# Altium schematic sheet PIBSchematic.SchDoc
size A4; SheetNumber: 1; SheetTotal: 1
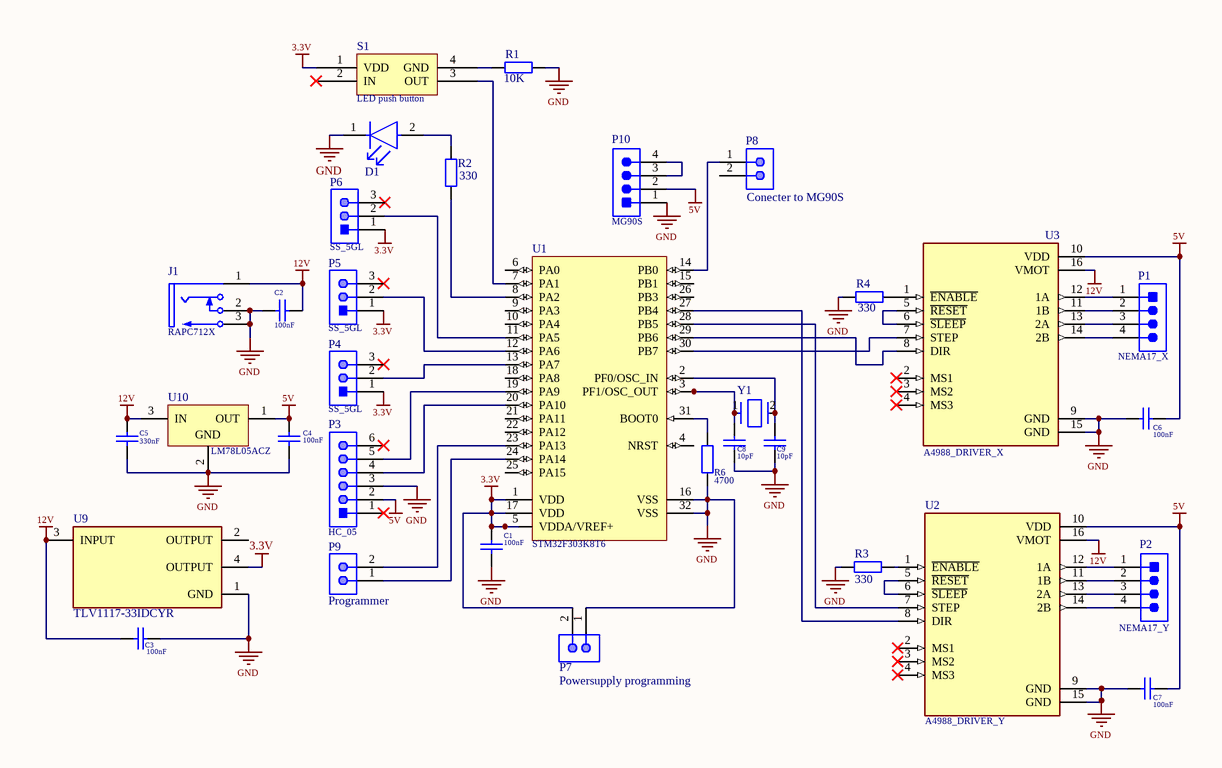
[diagram p0: PIBSchematic.SchDoc]

## Parts
C1  100nF  [KEMT-1206-2_M]
C2  100nF  [KEMT-1206-2_M]
C3  100nF  [KEMT-1206-2_M]
C4  100nF  [KEMT-1206-2_M]
C5  330nF  [KEMT-1206-2_M]
C6  100nF  [KEMT-1206-2_M]
C7  100nF  [KEMT-1206-2_M]
C8  10pF  [KEMT-1206-2_M]
C9  10pF  [KEMT-1206-2_M]
D1  HLMP-1719  [FP-HLMP-1719-MFG]  (value not drawn)
J1  RAPC712X  [SWITCH-RAPC712X-3_V]
P1  NEMA17_X  [TECO-640456-4]
P2  NEMA17_Y  [TECO-640456-4]
P3  HC_05  [66200611122]
P4  SS_5GL  [66200311122]
P5  SS_5GL  [66200311122]
P6  SS_5GL  [66200311122]
P7  Powersupply programming  [TECO-5-146280-2_V]
P8  Conecter to MG90S  [TECO-5-146280-2_V]
P9  Programmer  [TECO-5-146280-2_V]
P10  MG90S  [TECO-640456-4]
R1  value 10K  [AXIAL-0.4]  (hidden comment: Res2)
R2  value 330  [AXIAL-0.4]  (hidden comment: Res2)
R3  value 330  [AXIAL-0.4]  (hidden comment: Res2)
R4  value 330  [AXIAL-0.4]  (hidden comment: Res2)
R6  value 4700  [AXIAL-0.4]  (hidden comment: Res2)
S1  LED push button  [PCBComponent_1]
U1  STM32F303K8T6  [STM-LQFP32_M]
U2  A4988_DRIVER_Y  [MODULE_A4988_STEPPER_MOTOR_DRIVER_CARRIER]
U3  A4988_DRIVER_X  [MODULE_A4988_STEPPER_MOTOR_DRIVER_CARRIER]
U9  TLV1117-33IDCYR  [FP-DCY0004A-MFG]
U10  LM78L05ACZ  [LP0003A]
Y1  ABLS2-8.000MHZ-D4Y-T  [FP-ABLS2-MFG]  (value not drawn)

## Nets
3.3V: C1.2 P4.1 P5.1 P6.1 P7.2 S1.1(VDD) U1.1(VDD) U1.5(VDDA/VREF+) U1.17(VDD) U9.4(OUTPUT)
5V: C4.1 C6.1 C7.1 P3.2 P10.2 U2.10(VDD) U3.10(VDD) U10.1(OUT)
12V: C2.2 C3.2 C5.2 J1.1 U2.16(VMOT) U3.16(VMOT) U9.3(INPUT) U10.3(IN)
GND: C1.1 C2.1 C3.1 C4.2 C5.1 C6.2 C7.2 C8.2 C9.2 D1.1(C) J1.2 J1.3 P3.3 P7.1 P10.1 R1.2 R3.1 R4.1 R6.1 U1.16(VSS) U1.32(VSS) U2.9(GND) U2.15(GND) U3.9(GND) U3.15(GND) U9.1(GND) U10.2(GND)
NetC8_1: C8.1 U1.3(PF1/OSC_OUT) Y1.1
NetC9_1: C9.1 U1.2(PF0/OSC_IN) Y1.2
NetD1_2: D1.2(A) R2.2
NetP1_1: P1.1 U3.12(1A)
NetP1_2: P1.2 U3.11(1B)
NetP1_3: P1.3 U3.13(2A)
NetP1_4: P1.4 U3.14(2B)
NetP2_1: P2.1 U2.12(1A)
NetP2_2: P2.2 U2.11(1B)
NetP2_3: P2.3 U2.13(2A)
NetP2_4: P2.4 U2.14(2B)
NetP3_4: P3.4 U1.20(PA10)
NetP3_5: P3.5 U1.19(PA9)
NetP4_2: P4.2 U1.13(PA7)
NetP5_2: P5.2 U1.12(PA6)
NetP6_2: P6.2 U1.11(PA5)
NetP8_1: P8.1 U1.14(PB0)
NetP9_1: P9.1 U1.24(PA14)
NetP9_2: P9.2 U1.23(PA13)
NetP10_3: P10.3 P10.4
NetR1_1: R1.1 S1.4(GND)
NetR2_1: R2.1 U1.8(PA2)
NetR3_2: R3.2 U2.1(~{ENABLE})
NetR4_2: R4.2 U3.1(~{ENABLE})
NetR6_2: R6.2 U1.31(BOOT0)
NetS1_3: S1.3(OUT) U1.7(PA1)
NetU1_27: U1.27(PB4) U2.8(DIR)
NetU1_28: U1.28(PB5) U2.7(STEP)
NetU1_29: U1.29(PB6) U3.8(DIR)
NetU1_30: U1.30(PB7) U3.7(STEP)
NetU2_5: U2.5(~{RESET}) U2.6(~{SLEEP})
NetU3_5: U3.5(~{RESET}) U3.6(~{SLEEP})

Not connected (* = marked no-connect by the designer): P3 1* 6*; P4 3*; P5 3*; P6 3*; P8 2; S1 2(IN)*; U1 4(NRST) 6(PA0) 9(PA3) 10(PA4) 15(PB1) 18(PA8) 21(PA11) 22(PA12) 25(PA15) 26(PB3); U2 2(MS1)* 3(MS2)* 4(MS3)*; U3 2(MS1)* 3(MS2)* 4(MS3)*; U9 2(OUTPUT)

## Notes on the sheet
- Size:
- Date:
- Drawn by:
- Revision:
- Hogeschool Windesheim
- Campus 2-6
- Postbus 10090
- A4
- Sheet
- of
- 8000GB, Zwolle

## Library data of the parts
C1-C9 = CMP-1037-04202-2: CAP, Ceramic, 0.1 uF, +/- 10%, 50 V, -55 to 125 degC, 1206 (3216 Metric), RoHS, Tape and Reel; Manufacturer: Kemet; Voltage Rating: 50V; Capacitance: 0.1µF; Product Range: KEMET-CSeries; SVHC: ToBeAdvised; Dielectric Characteristic: X7R; Capacitor Case Style: 1206[3216Metric]; Package Reference: 1206-2; Package Description: 2-Leads SMD, Body 3.2 x 1.6 mm; Packaging: Tape&Reel; Operating Temperature Max: 125degC; Capacitance Tolerance: ±10%; Datasheet URL: https://datasheet.ciiva.com/6125/1725438-6125494.pdf; Manufacturer URL: http://www.kemet.com/; Operating Temperature Min: -55degC; Datasheet Version: Jul-13
D1 = CMP-2000-06410-2: LED YELLOW DIFFUSED T-1 T/H; Manufacturer: Broadcom; Wavelength: 585nm; Led Orientation: Straight; Luminous Intensity: 2.1mcd; Forward Voltage: 1.8V; Viewing Angle: 50°; Reverse Voltage: 5V; Power Dissipation: 17.5mW; Forward Current: 2mA; Lead Free: Yes; Automotive: No; Device Class L1: Optoelectronics; Mouser Description: Standard LEDs - Through Hole Yellow Diffused 585nm 2.1mcd; Digikey Description: LED YELLOW DIFFUSED T-1 T/H; Temperature: -40°C to +100°C; Temperature Range High: +100°C; Package: 0; Category: Diode; Colour: Yellow; Device Class L2: LEDs; ComponentLink2Description: Datasheet; ComponentLink2URL: https://docs.broadcom.com/docs/AV02-1557EN; Temperature Range Low: -40°C; Device Class L3: unset; Octopart: https://octopart.com/hlmp-1719-broadcom-71130405; RoHS: TRUE; Manufacturer Part Number: HLMP-1719
J1 = CMP-2000-05383-1: Conn Powerjack Mini R/A PCMT, 5 A, 3-Pin THD, RoHS; Manufacturer: Switchcraft; Gender: Male; Current Rating: 5A; Connector Type: Jack; Dynamic Catalog: SwitchcraftInc; Other Names: Q2387461 / Q2526383 / RAPC712X-ND / SC237; Internal Switch(s): SingleSwitch,NormallyClosed; Catalog Drawings: RAPC7(1,2)2XSide / RAPC7(1,2)2XTop; Plug/Mating Plug Diameter: 2.5mmID,5.5mmOD; Number of Positions/Contacts: 2Conductors,2Contacts; Shielding: Unshielded; Mating Products: SC1539-ND / -CONNPLUGMINIPWR2CONDBLK/RED / SC1051-ND / -CONNPLUGMINIPOWER2CONDBLACK; Mounting Type: ThroughHole,RightAngle; Manufacturer URL: http://www.switchcraft.com/; Contact Material: Brass; Standard Package: 2,500; RoHS Information: SwitchcraftRoHSInfo; Termination: SolderEyelet(s); Housing Color: Black; Datasheet Version: Rev. A, 08/2005; Family: Barrel-PowerConnectors; Housing Material: Thermoplastic; Color: Black; Datasheet URL: https://datasheet.ciiva.com/391/rapc712x-cd-391666.pdf; Category: Connectors,Interconnects; Contact Material - Plating: Nickel
P1 P2 P10 = CMP-2000-05419-1: Male Header, Pitch 2.54 mm, 1 x 4 Position, Height 10.03 mm, Tail Length 3.56 mm, RoHS, Bulk; Manufacturer: TE Connectivity; Material, Housing: Polyester; Primary Type: InterconnectSystem; Mount Angle: Vertical; Color, Housing: White; Current, Rating: 5 / A; Agency Approvals: CSA,UL; Contact Termination Area Plating: Tin; Temperature, Operating: -55to+105 / degC; Standards: RoHSCompliant,ELVCompliant,UL94V-0; Number of Positions: 4; Brand/Series: MTA-100Series; Angle: Straight; Pin Spacing: 0.1 / "; Material, Contact: CopperAlloy; Connector Type: MTA-100; Special Features: Pinstrip; Mounting Hole Size: 0.04 / "; Contact Centerline Spacing: 0.100 / in.; Voltage, Rating: 250 / V; Manufacturer URL: http://www.te.com/; Length, Pin: 0.14 / "; Length, Overall: 0.4 / "; Color: White; Flammability Rating: UL94V-0; Mounting Type: PCMount; Termination: Solder; Datasheet URL: https://datasheet.ciiva.com/16286/eng-ds-82056-mta-0608-16286228.pdf; Number of Contacts: 4; Contact Shape: Square; Contact Mating Area Plating: Tin; Length, Terminal Post: 0.14 / in.; Size, Post: 0.025 / in.; Contact Plating: Tin; Type: PCBPlug; Datasheet Version: Dec-14; Number of Rows: 1
P3 = CMP-1502-00444-1: THT Male Header WR-MPC3, Vertical, Single Row, pitch 3 mm, 6 pins; Manufacturer: Wurth Elektronik; Working Voltage: 250VAC; Contact Resistance: 10mOhm; Pin Number: 6; Pitch: 3mm; Package Reference: 66200611122; Manufacturer URL: http://www.we-online.de; Packaging: Tube; Operating Temperature: -40to105degC; Publisher: WurthElektronik; Datasheet URL: https://katalog.we-online.de/em/datasheet/6620xx11122.pdf; Mounting Technology: THT; Gender: Male; Part Number: 66200611122; Orientation: Vertical
P4-P6 = CMP-1502-00441-1: THT Male Header WR-MPC3, Vertical, Single Row, pitch 3 mm, 3 pins; Manufacturer: Wurth Elektronik; Pitch: 3mm; Contact Resistance: 10mOhm; Working Voltage: 250VAC; Pin Number: 3; Gender: Male; Operating Temperature: -40to105degC; Part Number: 66200311122; Publisher: WurthElektronik; Package Reference: 66200311122; Orientation: Vertical; Datasheet URL: https://katalog.we-online.de/em/datasheet/6620xx11122.pdf; Mounting Technology: THT; Manufacturer URL: http://www.we-online.de; Packaging: Tube
P7-P9 = CMP-2000-07492-1: Male Header, Pitch 2.54 mm, 1 x 2 Position, Height 8.21 mm, Tail Length 3.05 mm, -65 to 105 degC, RoHS, Bulk; Manufacturer: TE Connectivity; Mating Connector Lock: No(Without); Number of Positions: 2; Pitch: 2.54mm; PCB Mounting Orientation: Vertical; Keyed: No; Case\/Package: 100; Mating Post Length: 0.23inch; High Temperature Housing: Yes; Max Current Rating: 5A; PCB Thickness: 0.063inch; PCB Mount Retention: Without; Approvals: CSA; Current Rating: 3A; Radiation Hardening: No; Length: 4.67mm; Contact Mating Length: 0.23inch; Connector Type: Header; Number of Rows: 1; Termination Post Length: 0.12inch; Board Standoff: No(Without); Max Operating Temperature: 105degC; Contact Shape: Square; Selectively Loaded: No(Without); Gasket: No(Without); Number of Contacts: 2; Contact Gender: Male; Mating Alignment: No(Without); Manufacturer URL: http://www.te.com/; Datasheet URL: http://www.te.com/commerce/DocumentDelivery/DDEController?Action=showdoc&DocId=Customer+Drawing%7F146280%7FH1%7Fpdf%7FEnglish%7FENG_CD_146280_H1.pdf%7F5-146280-2; Mount: ThroughHole; Orientation: Straight; Packaging: Carton; Package Reference: 5-146280-2; Package Quantity: 500; Stabilizers: No(Without); Row Spacing: 2.54mm; Contact Material: CopperAlloy; Panel Mount Retention: No(Without); Datasheet Version: Rev. H1, 08/2016; Housing Colour: Black; Colour: Black; Package Description: Male Header, Pitch 2.54 mm, 1 x 2 Position, Height 8.21 mm, Tail Length 3.05 mm; Contact Plating: Matte; Housing Material: Polymer; Contact Protection: No(Without); Min Operating Temperature: -65degC; Mounting Technology: ThroughHole; Flammability Rating: UL94V-0; RoHSCompliant: true; Termination: ThroughHole; Depth: 2.34mm; High Speed Serial Data Connector: No
R1-R4 R6 = Res2: Resistor; Published: 8-Jun-2000; LatestRevisionDate: 17-Jul-2002; LatestRevisionNote: Re-released for DXP Platform.; PackageReference: AXIAL-0.4; Publisher: Altium Limited; PackageDescription: Axial Device, Thru-Hole; 2 Leads; 0.4 in Pin Spacing
U1 = CMP-0537-00040-1: ARM Cortex-M4 32-bit MCU, 64 KB Flash, 16 KB Internal RAM, 25 I/Os, 32-Pin LQFP, -40 to 85 degC, Tray; Supply Voltage(Vcc) min (V): 2; Internal RAM Size (kB): 16; D/A Converter: 3; FLASH Size (Prog) (kB): 64; I/Os (High Current): 25; Operating Frequency(F) (Processor speed) (MHz): 72; ComponentLink1URL: http://www.st.com/; Package Description: 32-Pin Low Profile Quad Flat Package, 7 x 7 mm Body, 0.8 mm Pitch; Mounting Technology: Surface Mount; ComponentLink2Description: Datasheet; ComponentLink2URL: http://www.st.com/st-web-ui/static/active/en/resource/technical/document/datasheet/DM00092070.pdf; Core: ARM Cortex-M4; ComponentLink1Description: Manufacturer URL; Package Reference: LQFP32; Packing: Tray; DatasheetVersion: Rev. 4
U2 U3 = A4988_STEPPER_MOTOR_DRIVER_CARRIER: Stepper Motor Driver; MP: A4988 STEPPER MOTOR DRIVER CARRIER; MF: Pololu; Availability: Unavailable; Price: None; Package: None; Value: *; SnapEDA_Link: https://www.snapeda.com/parts/A4988%20STEPPER%20MOTOR%20DRIVER%20CARRIER/Pololu/view-part/1499394/?ref=snap
U9 = CMP-04917-000056-1: IC REG LIN 3.3V 800MA SOT223-4; Manufacturer: Texas Instruments; Nominal Supply Current: 5mA; Dropout Voltage: 1.2V; Max Supply Voltage: 15V; Min Supply Voltage: 4.7V; Output Type: Fixed; Number Of Outputs: 1; Output Current: 0.8A; Standoff Height: 0.02mm; Max Junction Temp: +125°C; Lead Free: Yes; RoHS: TRUE; Temperature: -40°C to +125°C; Device Class L1: Integrated Circuits (ICs); Output Voltage: 3.3V; Device Class L3: Voltage Regulators - Linear; Octopart: https://octopart.com/tlv1117-33idcyr-texas+instruments-669250; Device Class L2: Power Management ICs; Package: DCY0004A; Temperature Range High: +125°C; Category: IC; Height: 1.8mm; Automotive: No; Digikey Description: IC REG LIN 3.3V 800MA SOT223-4; Temperature Range Low: -40°C; ComponentLink2URL: http://www.ti.com/lit/ds/symlink/tlv1117.pdf; ComponentLink2Description: Datasheet; Manufacturer Part Number: TLV1117-33IDCYR; Mouser Description: LDO Voltage Regulators Fixed LDO Volt Reg
U10 = CMP-0062-00040-4: 3-Terminal Positive Regulator, 5 Vout, 3-pin TO-92, Pb-Free; PartNumber: LM78L05ACZ/NOPB; Manufacturer: Texas Instruments; High-Reliability: Y; PackageTopMarking: NSXYTT*LM78L*05ACZ; CompType: LDO IC; PowerWise: N; Code_JEDEC: TO-226-AA; ComponentLink1Description: Datasheet URL; RoHS: Y; PinCount: 3; PackageDescription: TO-92, Molded, 3 Lead; ComponentLink1URL: http://www.ti.com/general/docs/lit/getliterature.tsp?genericPartNumber=LM78L05&fileType=pdf; PackageReference: LP0003A
Y1 = CMP-27762-001729-1: CRYSTAL 8.0000MHZ 18PF SMD; Series Resistance: 80R; Tolerance: 30ppm; Frequency: 8MHz; Operating Frequency: 8 MHz; Packaging: Tape and Reel; Number of Pins: 2; Mount: Surface Mount; Package Quantity: 1000; Series: ABLS2; Min Operating Temperature: -40°C; Termination: SMD/SMT; Load Capacitance: 18pF; Lead Free: Lead Free; Frequency Tolerance: 30ppm; RoHS Compliant: Yes; Length: 11.4mm; Width: 4.7mm; Height: 0.13inch; ESR (Equivalent Series Resistance): 80R; Max Operating Temperature: 85°C; Depth: 4.7mm; Frequency Stability: 30ppm